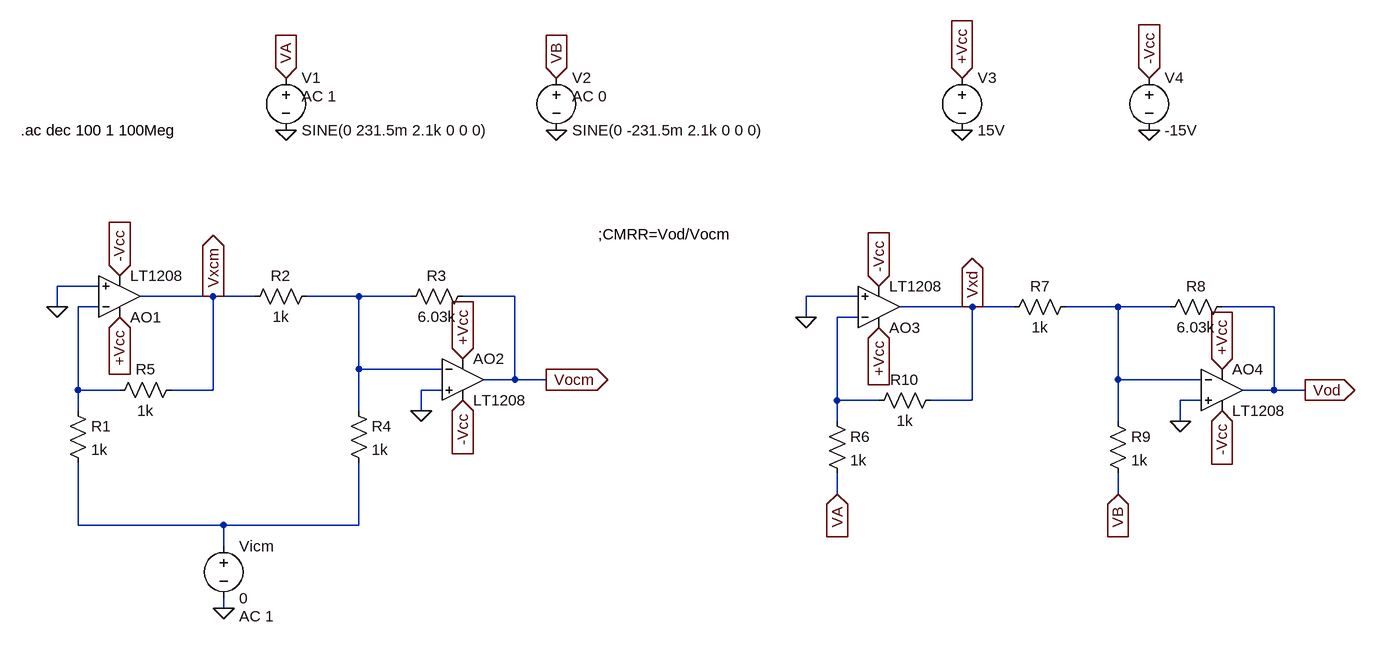
[diagram p0: schematic CMRR_Etaj_I.asc]
CMRR_Etaj_I.asc, the LTspice schematic file:
Version 4.1
SHEET 1 3108 680
WIRE -880 -256 -944 -256
WIRE -704 -240 -816 -240
WIRE -640 -240 -704 -240
WIRE -480 -240 -560 -240
WIRE -400 -240 -480 -240
WIRE -240 -240 -320 -240
WIRE 288 -240 208 -240
WIRE -944 -224 -944 -256
WIRE -880 -224 -912 -224
WIRE 464 -224 352 -224
WIRE 528 -224 464 -224
WIRE 688 -224 608 -224
WIRE 768 -224 688 -224
WIRE 928 -224 848 -224
WIRE 208 -208 208 -240
WIRE 288 -208 256 -208
WIRE -480 -128 -480 -240
WIRE -352 -128 -480 -128
WIRE -240 -112 -240 -240
WIRE -240 -112 -288 -112
WIRE -192 -112 -240 -112
WIRE 688 -112 688 -224
WIRE 816 -112 688 -112
WIRE -912 -96 -912 -224
WIRE -848 -96 -912 -96
WIRE -704 -96 -704 -240
WIRE -704 -96 -768 -96
WIRE -352 -96 -384 -96
WIRE 928 -96 928 -224
WIRE 928 -96 880 -96
WIRE 976 -96 928 -96
WIRE 256 -80 256 -208
WIRE 320 -80 256 -80
WIRE 464 -80 464 -224
WIRE 464 -80 400 -80
WIRE 816 -80 784 -80
WIRE -912 -64 -912 -96
WIRE -480 -64 -480 -128
WIRE -384 -64 -384 -96
WIRE 256 -48 256 -80
WIRE 688 -48 688 -112
WIRE 784 -48 784 -80
WIRE 256 64 256 32
WIRE 688 64 688 32
WIRE -912 112 -912 16
WIRE -688 112 -912 112
WIRE -480 112 -480 16
WIRE -480 112 -688 112
WIRE -688 144 -688 112
WIRE -688 240 -688 224
FLAG -944 -224 0
FLAG -384 -64 0
FLAG -192 -112 Vocm
IOPIN -192 -112 Out
FLAG -848 -208 +Vcc
IOPIN -848 -208 In
FLAG -320 -144 +Vcc
IOPIN -320 -144 In
FLAG -848 -272 -Vcc
IOPIN -848 -272 In
FLAG -320 -80 -Vcc
IOPIN -320 -80 In
FLAG -704 -240 Vxcm
IOPIN -704 -240 Out
FLAG -592 -496 0
FLAG -176 -496 0
FLAG -592 -576 VA
IOPIN -592 -576 In
FLAG -176 -576 VB
IOPIN -176 -576 In
FLAG 448 -576 +Vcc
IOPIN 448 -576 In
FLAG 736 -576 -Vcc
IOPIN 736 -576 In
FLAG 448 -496 0
FLAG 736 -496 0
FLAG -688 240 0
FLAG 208 -208 0
FLAG 784 -48 0
FLAG 688 64 VB
IOPIN 688 64 In
FLAG 256 64 VA
IOPIN 256 64 In
FLAG 976 -96 Vod
IOPIN 976 -96 Out
FLAG 320 -192 +Vcc
IOPIN 320 -192 In
FLAG 848 -128 +Vcc
IOPIN 848 -128 In
FLAG 320 -256 -Vcc
IOPIN 320 -256 In
FLAG 848 -64 -Vcc
IOPIN 848 -64 In
FLAG 464 -224 Vxd
IOPIN 464 -224 Out
SYMBOL OpAmps\\LT1208 -848 -176 M180
SYMATTR InstName AO1
SYMBOL res -928 -80 R0
SYMATTR InstName R1
SYMATTR Value 1k
SYMBOL res -656 -224 R270
WINDOW 0 32 56 VTop 2
WINDOW 3 0 56 VBottom 2
SYMATTR InstName R2
SYMATTR Value 1k
SYMBOL res -416 -224 R270
WINDOW 0 32 56 VTop 2
WINDOW 3 0 56 VBottom 2
SYMATTR InstName R3
SYMATTR Value 6.03k
SYMBOL res -496 -80 R0
SYMATTR InstName R4
SYMATTR Value 1k
SYMBOL OpAmps\\LT1208 -320 -176 R0
SYMATTR InstName AO2
SYMBOL res -864 -80 R270
WINDOW 0 32 56 VTop 2
WINDOW 3 0 56 VBottom 2
SYMATTR InstName R5
SYMATTR Value 1k
SYMBOL voltage -592 -592 R0
WINDOW 123 24 44 Left 2
WINDOW 39 0 0 Left 0
SYMATTR Value2 AC 1
SYMATTR InstName V1
SYMATTR Value SINE(0 231.5m 2.1k 0 0 0)
SYMBOL voltage -176 -592 R0
WINDOW 123 24 44 Left 2
WINDOW 39 0 0 Left 0
SYMATTR Value2 AC 0
SYMATTR InstName V2
SYMATTR Value SINE(0 -231.5m 2.1k 0 0 0)
SYMBOL voltage 448 -592 R0
WINDOW 123 24 44 Left 2
WINDOW 39 0 0 Left 0
SYMATTR InstName V3
SYMATTR Value 15V
SYMBOL voltage 736 -592 R0
SYMATTR InstName V4
SYMATTR Value -15V
SYMBOL voltage -688 128 R0
WINDOW 123 24 124 Left 2
WINDOW 39 0 0 Left 0
SYMATTR Value2 AC 1
SYMATTR InstName Vicm
SYMATTR Value 0
SYMBOL OpAmps\\LT1208 320 -160 M180
SYMATTR InstName AO3
SYMBOL res 240 -64 R0
SYMATTR InstName R6
SYMATTR Value 1k
SYMBOL res 512 -208 R270
WINDOW 0 32 56 VTop 2
WINDOW 3 0 56 VBottom 2
SYMATTR InstName R7
SYMATTR Value 1k
SYMBOL res 752 -208 R270
WINDOW 0 32 56 VTop 2
WINDOW 3 0 56 VBottom 2
SYMATTR InstName R8
SYMATTR Value 6.03k
SYMBOL res 672 -64 R0
SYMATTR InstName R9
SYMATTR Value 1k
SYMBOL OpAmps\\LT1208 848 -160 R0
SYMATTR InstName AO4
SYMBOL res 304 -64 R270
WINDOW 0 32 56 VTop 2
WINDOW 3 0 56 VBottom 2
SYMATTR InstName R10
SYMATTR Value 1k
TEXT -1000 -496 Left 2 !.ac dec 100 1 100Meg
TEXT -112 -336 Left 2 !;CMRR=Vod/Vocm

The netlist it stands for:
* CMRR_Etaj_I.asc
X§AO1 0 N002 +Vcc -Vcc Vxcm LT1208  ; pins In+ In- V+ V- OUT
R1 N002 N005 1k
R2 Vxcm N001 1k
R3 N001 Vocm 6.03k
R4 N001 N005 1k
X§AO2 0 N001 +Vcc -Vcc Vocm LT1208  ; pins In+ In- V+ V- OUT
R5 N002 Vxcm 1k
V1 VA 0 SINE(0 231.5m 2.1k 0 0 0) AC 1
V2 VB 0 SINE(0 -231.5m 2.1k 0 0 0) AC 0
V3 +Vcc 0 15V
V4 -Vcc 0 -15V
Vicm N005 0 0 AC 1
X§AO3 0 N004 +Vcc -Vcc Vxd LT1208  ; pins In+ In- V+ V- OUT
R6 N004 VA 1k
R7 Vxd N003 1k
R8 N003 Vod 6.03k
R9 N003 VB 1k
X§AO4 0 N003 +Vcc -Vcc Vod LT1208  ; pins In+ In- V+ V- OUT
R10 N004 Vxd 1k
.ac dec 100 1 100Meg
;CMRR=Vod/Vocm
.backanno
.end